# EasyEDA schematic SCH_oscilliscope copy_2021-09-11.json
TITLE: oscilliscope; REV: 1.0; Date: 2020-11-22; Sheet: 1/1; Drawn By: paabel2; Company: Your Company
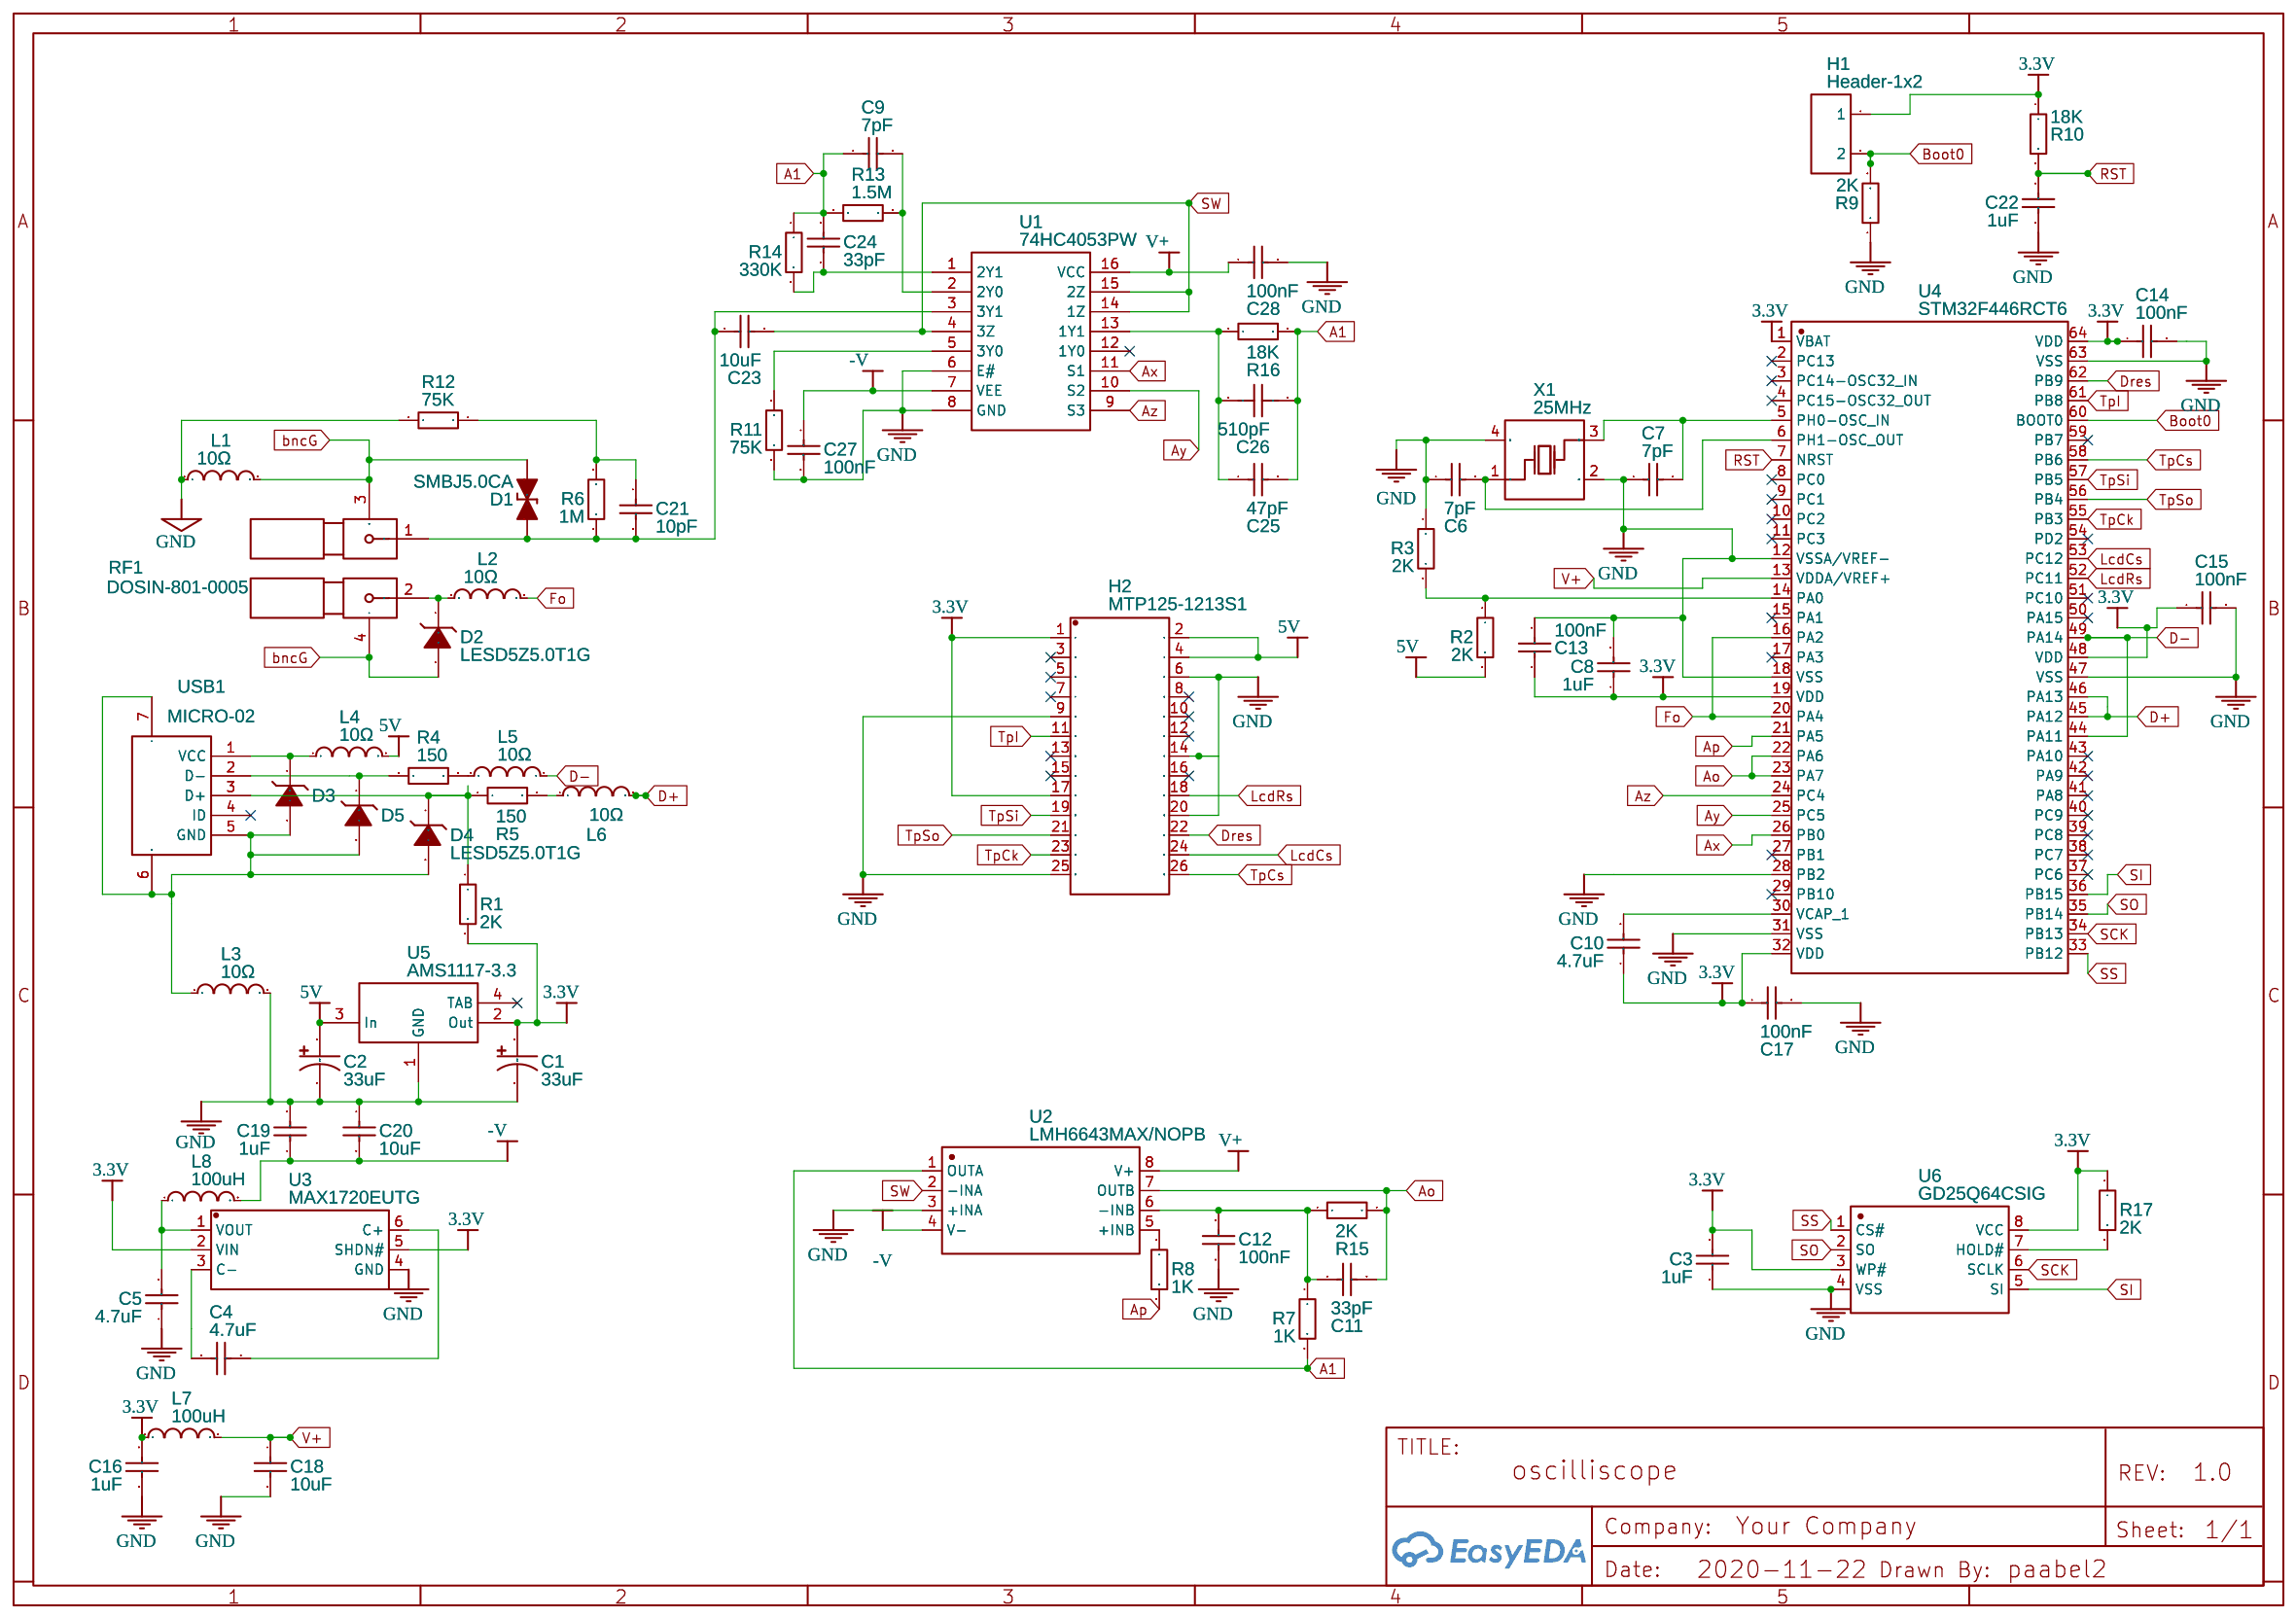
[diagram p0: schematic sheet]

## Parts
C1  33uF  [CAP-SMD_L3.2-W1.6-R-RD]
C2  33uF  [CAP-SMD_L3.2-W1.6-R-RD]
C3  1uF  [C0402]
C4  4.7uF  [C0805]
C5  4.7uF  [C0805]
C6  7pF  [C0402]
C7  7pF  [C0402]
C8  1uF  [C0402]
C9  7pF  [C0402]
C10  4.7uF  [C0805]
C11  33pF  [C0402]
C12  100nF  [C0402_NEW]
C13  100nF  [C0402_NEW]
C14  100nF  [C0402_NEW]
C15  100nF  [C0402_NEW]
C16  1uF  [C0402]
C17  100nF  [C0402_NEW]
C18  10uF  [C0805]
C19  1uF  [C0402]
C20  10uF  [C0805]
C21  10pF  [C0603]
C22  1uF  [C0402]
C23  10uF  [C0805]
C24  33pF  [C0402]
C25  47pF  [C0603]
C26  510pF  [C0603]
C27  100nF  [C0402_NEW]
C28  100nF  [C0402_NEW]
D1  SMBJ5.0CA  [SMB_L4.6-W3.6-LS5.3-BI]
D2  LESD5Z5.0T1G  [SOD-523_L1.2-W0.8-LS1.6-RD]
D3  LESD5Z5.0T1G  [SOD-523_L1.2-W0.8-LS1.6-RD]
D4  LESD5Z5.0T1G  [SOD-523_L1.2-W0.8-LS1.6-RD]
D5  LESD5Z5.0T1G  [SOD-523_L1.2-W0.8-LS1.6-RD]
H1  Header-1x2  [HDR-TH_2P-P2.54-V-M-1]
H2  MTP125-1213S1  [HDR-TH_26P-P2.54-V-M-R2-C13-S2.54]
L1  10Ω  [L0402]
L2  10Ω  [L0402]
L3  10Ω  [L0402]
L4  10Ω  [L0402]
L5  10Ω  [L0402]
L6  10Ω  [L0402]
L7  100uH  [IND-SMD_L3.5-W3.0]
L8  100uH  [IND-SMD_L3.5-W3.0]
R1  2K  [R0603]
R2  2K  [R0603]
R3  2K  [R0603]
R4  150  [R0603]
R5  150  [R0603]
R6  1M  [R0603]
R7  1K  [R0603]
R8  1K  [R0603]
R9  2K  [R0603]
R10  18K  [R0603]
R11  75K  [R0603]
R12  75K  [R0603]
R13  1.5M  [R0603]
R14  330K  [R0603]
R15  2K  [R0603]
R16  18K  [R0603]
R17  2K  [R0603]
RF1  DOSIN-801-0005  [BNC-TH_DOSIN-801-0005]
U1  74HC4053PW  [TSSOP-16_L5.0-W4.4-P0.65-LS6.4-BL]
U2  LMH6643MAX/NOPB  [SOIC-8_L4.9-W3.9-P1.27-LS6.0-BL]
U3  MAX1720EUTG  [TSOP-6_L3.0-W1.5-P0.95-LS2.8-BR]
U4  STM32F446RCT6  [LQFP-64_L10.0-W10.0-P0.50-LS12.0-BL]
U5  AMS1117-3.3  [SOT-223_L6.5-W3.5-P2.30-LS7.0-BR]
U6  GD25Q64CSIG  [SOP-8_L5.3-W5.3-P1.27-LS8.0-BL]
USB1  MICRO-02  [MICRO-USB-SMD_MICRO-02-GXPX-A1T2]
X1  25MHz  [OSC-SMD_4P-L3.2-W2.5-BL]

## Library data of the parts
C1 C2 = TC211A336M006Y: Supplier: LCSC; Supplier Part: C128344; Manufacturer: Sunlord; Contributor: LCSC; SMT Type: Extend; JLCPCB SMD: Yes; LCSC Assembly: Yes; JLCPCB Part Class: Extended Part
C3 C8 C16 C19 C22 = CL05A105KP5NNNC: Supplier: LCSC; Manufacturer: SAMSUNG; Supplier Part: C14445; JLCPCB Part Class: Extended Part
C4 C5 C10 = CL21A475KAQNNNE: Supplier: LCSC; Manufacturer: SAMSUNG; LCSC Assembly: Yes; Supplier Part: C1779; SMT Type: Basic; JLCPCB Part Class: Basic Part
C6 C7 C9 = 0402CG7R0C500NT: Supplier: LCSC; Manufacturer: FH; Supplier Part: C1577; JLCPCB Part Class: Extended Part
C11 C24 = 0402CG330J500NT: Supplier: LCSC; Manufacturer: FH; Supplier Part: C1562; JLCPCB Part Class: Basic Part
C12-C15 C17 C27 C28 = CL05B104KO5NNNC: Supplier: LCSC; Manufacturer: SAMSUNG; Supplier Part: C1525; JLCPCB Part Class: Basic Part
C18 C20 C23 = CL21A106KAYNNNE: Supplier: LCSC; Manufacturer: SAMSUNG; Supplier Part: C15850; SMT Type: Basic; JLCPCB SMD: Yes; JLCPCB Part Class: Basic Part
C21 = CL10C100JB8NNNC: Supplier: LCSC; Manufacturer: SAMSUNG; Supplier Part: C1634; SMT Type: Basic; JLCPCB SMD: Yes; JLCPCB Part Class: Basic Part
C25 = CL10C470JB8NNNC: Supplier: LCSC; Manufacturer: SAMSUNG; Supplier Part: C1671; SMT Type: Basic; JLCPCB SMD: Yes; JLCPCB Part Class: Basic Part
C26 = CL10B511KB8NNNC: Supplier: LCSC; Manufacturer: SAMSUNG; Contributor: LCSC; Supplier Part: C170144; SMT Type: Extend; JLCPCB SMD: Yes; JLCPCB Part Class: Extended Part
D1 = SMBJ5.0CA-C78424: Supplier: LCSC; Manufacturer: Brightking; image: //image.lceda.cn/szlcsc/C78424.jpg; Supplier Part: C78424; LCSC Assembly: Yes; SMT Type: Extend; JLCPCB Part Class: Extended Part
D2-D5 = LESD5Z5.0T1G: Supplier: LCSC; Manufacturer: LRC; Contributor: LCSC; Supplier Part: C136171; LCSC Assembly: Yes; SMT Type: Extend; JLCPCB Part Class: Extended Part
H1 = Header-Male-2.54_1x2: Supplier: LCSC; Manufacturer: TE Connectivity; Manufacturer Part: 826629-2; image: //image.lceda.cn/szlcsc/C86471.jpg; Supplier Part: C86471; LCSC Assembly: Yes; SMT Type: Extend; Assembly Type: manualWeld; Paste Type: expand; JLCPCB Part Class: Extended Part
H2 = MTP125-1213S1: Supplier: LCSC; Supplier Part: C358701; Manufacturer: MINTRON; Contributor: LCSC; JLCPCB Part Class: Extended Part
L1-L6 = BLM15AG100SN1D: Supplier: LCSC; Manufacturer: MuRata; Supplier Part: C76882; LCSC Assembly: Yes; SMT Type: Extend; JLCPCB Part Class: Extended Part
L7 L8 = SCCD32-101KT: Supplier: LCSC; Supplier Part: C532859; Manufacturer: Yanchuang; Contributor: LCSC; SMT Type: Extend; JLCPCB SMD: Yes; JLCPCB Part Class: Extended Part
R1 R3 = 0603WAF2001T5E: Supplier: LCSC; Manufacturer: UniOhm; LCSC Assembly: Yes; Supplier Part: C22975; SMT Type: Basic; JLCPCB Part Class: Basic Part
R2 R17 = 0603WAF2001T5E: Supplier: LCSC; Manufacturer: UniOhm; LCSC Assembly: Yes; Supplier Part: C22975; SMT Type: Basic; JLCPCB SMD: Yes; JLCPCB Part Class: Basic Part
R4 R5 = 0603WAF1500T5E: Supplier: LCSC; Manufacturer: UniOhm; LCSC Assembly: Yes; Supplier Part: C22808; SMT Type: Basic; JLCPCB Part Class: Basic Part
R6 = 0603WAF1004T5E: Supplier: LCSC; Manufacturer: UniOhm; Supplier Part: C22935; SMT Type: Basic; JLCPCB SMD: Yes; JLCPCB Part Class: Basic Part
R7 R8 = 0603WAF1001T5E: Supplier: LCSC; Manufacturer: UniOhm; Supplier Part: C21190; SMT Type: Basic; JLCPCB SMD: Yes; JLCPCB Part Class: Basic Part
R9 = 0603WAF2001T5E: Supplier: LCSC; Manufacturer: UniOhm; Supplier Part: C22975; SMT Type: Basic; LCSC Assembly: Yes; JLCPCB Part Class: Basic Part
R10 R16 = 0603WAF1802T5E: Supplier: LCSC; Manufacturer: UniOhm; Supplier Part: C25810; SMT Type: Basic; JLCPCB SMD: Yes; JLCPCB Part Class: Basic Part
R11 R12 = 0603WAF7502T5E: Supplier: LCSC; Manufacturer: UniOhm; Supplier Part: C23242; SMT Type: Basic; JLCPCB SMD: Yes; JLCPCB Part Class: Basic Part
R13 = 0603WAF1504T5E: Supplier: LCSC; Manufacturer: UniOhm; Supplier Part: C4172; JLCPCB Part Class: Basic Part
R14 = RTT03334JTP: Supplier: LCSC; Manufacturer: RALEC; Supplier Part: C103555; JLCPCB Part Class: Extended Part
R15 = 0603WAF2001T5E: Supplier: LCSC; Manufacturer: UniOhm; Supplier Part: C22975; SMT Type: Basic; JLCPCB SMD: Yes; JLCPCB Part Class: Basic Part
RF1 = DOSIN-801-0005: Supplier: LCSC; Supplier Part: C521213; Manufacturer: dosinconn; Contributor: LCSC; LCSC Assembly: Yes; SMT Type: Extend; Assembly Type: manualWeld; Paste Type: expand; JLCPCB Part Class: Extended Part
U1 = 74HC4053PW: Supplier: LCSC; Manufacturer: PHILIPS; image: //image.lceda.cn/szlcsc/C5648.jpg; Supplier Part: C5648; LCSC Assembly: Yes; SMT Type: Extend; JLCPCB Part Class: Extended Part
U2 = LMH6643MAX/NOPB: Supplier: LCSC; Manufacturer: TI; image: //image.lceda.cn/szlcsc/C44880.jpg; Supplier Part: C44880; LCSC Assembly: Yes; SMT Type: Extend; JLCPCB Part Class: Extended Part
U3 = MAX1720EUTG: Supplier: LCSC; Supplier Part: C70466; Manufacturer: ON Semicon; Contributor: LCSC; SMT Type: Extend; JLCPCB SMD: Yes; LCSC Assembly: Yes; JLCPCB Part Class: Extended Part
U4 = STM32F446RET6: Supplier: LCSC; Manufacturer: STMicroelectronics; Supplier Part: C69336; LCSC Assembly: Yes; SMT Type: Extend; subpart_no: 1; JLCPCB Part Class: Extended Part
U5 = AMS1117-3.3_C165482: Supplier: LCSC; Supplier Part: C165482; Manufacturer: SK; Contributor: LCSC; SMT Type: Extend; JLCPCB SMD: Yes; LCSC Assembly: Yes; JLCPCB Part Class: Extended Part
U6 = GD25Q64CSIG: Supplier: LCSC; Manufacturer: GigaDevice; Supplier Part: C79076; SMT Type: Extend; JLCPCB SMD: Yes; JLCPCB Part Class: Extended Part
USB1 = MICRO-02-G1P3-A1T2: Supplier: LCSC; Supplier Part: C2682518; Manufacturer: Yuandi(台湾元迪); Contributor: LCSC; JLCPCB Part Class: Extended Part
X1 = X322525MOB4SI: Supplier: LCSC; Manufacturer: YXC; LCSC Assembly: Yes; Supplier Part: C9006; SMT Type: Basic; JLCPCB Part Class: Basic Part

## Nets
3.3V: C1.1 C3.2 C8.1 C10.1 C13.1 C14.1 C15.1 C16.2 C17.1 H1.1 H2.1 H2.17 L7.1 R1.2 R10.1 R17.1 U3.2(VIN) U3.5(SHDN#) U4.1(VBAT) U4.19(VDD) U4.32(VDD) U4.48(VDD) U4.64(VDD) U5.2(Out) U6.3(WP#) U6.8(VCC)
5V: C2.1 H2.2 H2.4 L4.2 R2.2 U5.3(In)
GND: C1.2 C2.2 C3.1 C5.1 C6.1 C7.1 C8.2 C12.2 C13.2 C14.2 C15.2 C16.1 C17.2 C18.2 C19.2 C20.1 C22.1 C27.2 C28.2 H2.6 H2.9 H2.14 H2.20 H2.25 L1.1 L3.2 R3.1 R9.1 R11.1 R12.2 U1.6(E#) U1.8(GND) U2.3(+INA) U3.4(GND) U4.12(VSSA/VREF-) U4.18(VSS) U4.28(PB2) U4.31(VSS) U4.47(VSS) U4.63(VSS) U5.1(GND) U6.4(VSS) X1.2(GND) X1.4(GND)
-V: C19.1 C20.2 C27.1 L8.2 U1.7(VEE) U2.4(V-)
A1: C9.1 C24.2 C25.2 C26.1 R7.2 R13.1 R14.1 R16.2 U2.1(OUTA)
Ao: C11.2 R15.2 U2.7(OUTB) U4.22(PA6) U4.23(PA7)
Ap: R8.2 U4.21(PA5)
Ax: U1.11(S1) U4.26(PB0)
Ay: U1.10(S2) U4.25(PC5)
Az: U1.9(S3) U4.24(PC4)
bncG: D1.1 D2.2(A) L1.2 RF1.3 RF1.4
Boot0: H1.2 R9.2 U4.60(BOOT0)
D+: L6.2 U4.45(PA12) U4.46(PA13)
D-: L5.2 U4.44(PA11) U4.49(PA14)
Dres: H2.22 U4.62(PB9)
Fo: L2.2 U4.16(PA2) U4.20(PA4)
LcdCs: H2.24 U4.53(PC12)
LcdRs: H2.18 U4.52(PC11)
RST: C22.2 R10.2 U4.7(NRST)
SCK: U4.34(PB13) U6.6(SCLK)
SI: U4.36(PB15) U6.5(SI)
SO: U4.35(PB14) U6.2(SO)
SS: U4.33(PB12) U6.1(CS#)
SW: C23.2 U1.4(3Z) U1.14(1Z) U1.15(2Z) U2.2(-INA)
TpCk: H2.23 U4.55(PB3)
TpCs: H2.26 U4.58(PB6)
TpI: H2.11 U4.61(PB8)
TpSi: H2.19 U4.57(PB5)
TpSo: H2.21 U4.56(PB4)
V+: C18.1 C28.1 L7.2 U1.16(VCC) U2.8(V+) U4.13(VDDA/VREF+)
Net-(C4-1): C4.1 U3.3(C-)
Net-(C4-2): C4.2 U3.6(C+)
Net-(C5-2): C5.2 L8.1 U3.1(VOUT)
Net-(C6-2): C6.2 U4.6(PH1-OSC_OUT) X1.1(OSC1)
Net-(C7-2): C7.2 U4.5(PH0-OSC_IN) X1.3(OSC2)
Net-(C9-2): C9.2 R13.2 U1.2(2Y0)
Net-(C10-2): C10.2 U4.30(VCAP_1)
Net-(C11-1): C11.1 C12.1 R7.1 R15.1 U2.6(-INB)
Net-(C21-1): C21.1 R6.2 R12.1
Net-(C21-2): C21.2 C23.1 D1.2 R6.1 RF1.1 U1.3(3Y1)
Net-(C24-1): C24.1 R14.2 U1.1(2Y1)
Net-(C25-1): C25.1 C26.2 R16.1 U1.13(1Y1)
Net-(D2-1): D2.1(C) L2.1 RF1.2
Net-(D3-1): D3.1(C) L4.1 USB1.1(VCC)
Net-(D3-2): D3.2(A) D4.2(A) D5.2(A) L3.1 USB1.5(GND) USB1.6 USB1.7
Net-(D4-1): D4.1(C) R1.1 R5.1 USB1.3(D+)
Net-(D5-1): D5.1(C) R4.1 USB1.2(D-)
Net-(L5-1): L5.1 R4.2
Net-(L6-1): L6.1 R5.2
Net-(R2-1): R2.1 R3.2 U4.14(PA0)
Net-(R8-1): R8.1 U2.5(+INB)
Net-(R11-2): R11.2 U1.5(3Y0)
Net-(R17-2): R17.2 U6.7(HOLD#)

Not connected (* = marked no-connect by the designer): H2 3* 5* 7* 8* 10* 12* 13* 15* 16*; U1 12(1Y0)*; U4 2(PC13)* 3(PC14-OSC32_IN)* 4(PC15-OSC32_OUT)* 8(PC0)* 9(PC1)* 10(PC2)* 11(PC3)* 15(PA1)* 17(PA3)* 27(PB1)* 29(PB10)* 37(PC6)* 38(PC7)* 39(PC8)* 40(PC9)* 41(PA8)* 42(PA9)* 43(PA10)* 50(PA15)* 51(PC10)* 54(PD2)* 59(PB7)*; U5 4(TAB)*; USB1 4(ID)*
